# Altium schematic sheet IO.SchDoc
size A3
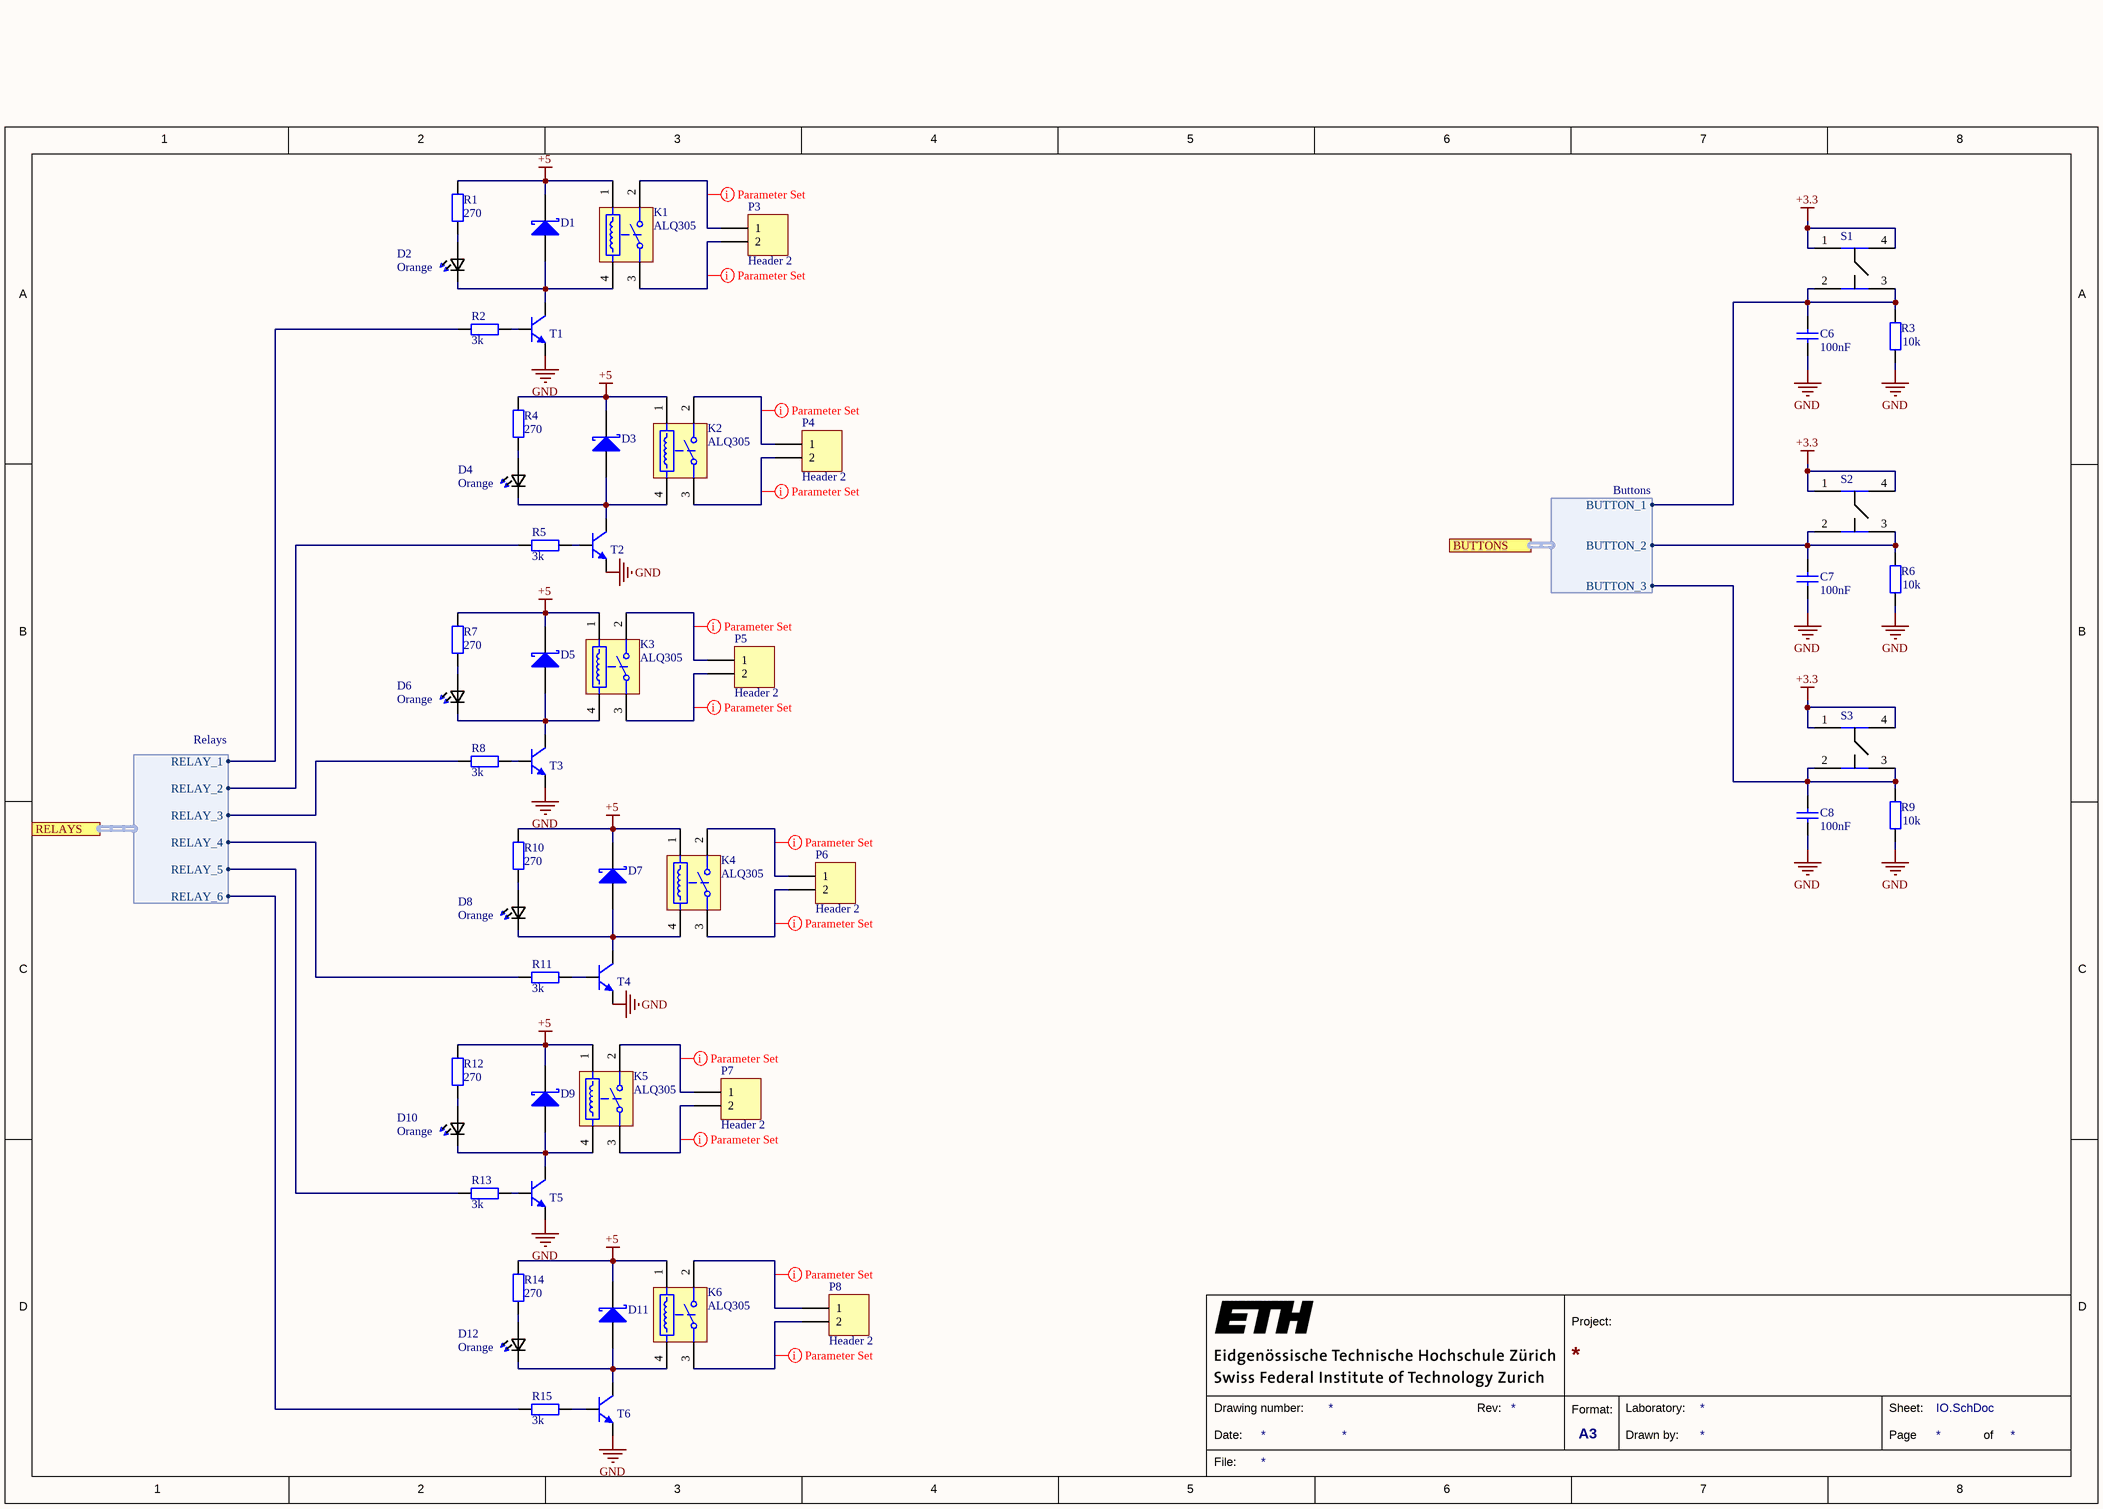
[diagram p0: IO.SchDoc]

## Parts
C6  100nF  [CAP_0603i_1608m -N]
C7  100nF  [CAP_0603i_1608m -N]
C8  100nF  [CAP_0603i_1608m -N]
D1  Diode  Schottky  [SOD123]  (value not drawn)
D2  Orange  [*0603]
D3  Diode  Schottky  [SOD123]  (value not drawn)
D4  Orange  [*0603]
D5  Diode  Schottky  [SOD123]  (value not drawn)
D6  Orange  [*0603]
D7  Diode  Schottky  [SOD123]  (value not drawn)
D8  Orange  [*0603]
D9  Diode  Schottky  [SOD123]  (value not drawn)
D10  Orange  [*0603]
D11  Diode  Schottky  [SOD123]  (value not drawn)
D12  Orange  [*0603]
K1  ALQ305  [PNSC-LQ-4-2000x1000x1600_V]
K2  ALQ305  [PNSC-LQ-4-2000x1000x1600_V]
K3  ALQ305  [PNSC-LQ-4-2000x1000x1600_V]
K4  ALQ305  [PNSC-LQ-4-2000x1000x1600_V]
K5  ALQ305  [PNSC-LQ-4-2000x1000x1600_V]
K6  ALQ305  [PNSC-LQ-4-2000x1000x1600_V]
P3  Header 2  [3.5MM Phoenix Contact 1984617]
P4  Header 2  [3.5MM Phoenix Contact 1984617]
P5  Header 2  [3.5MM Phoenix Contact 1984617]
P6  Header 2  [3.5MM Phoenix Contact 1984617]
P7  Header 2  [3.5MM Phoenix Contact 1984617]
P8  Header 2  [3.5MM Phoenix Contact 1984617]
R1  270  [RES_0603i_1608m -N]
R2  3k  [RES_0603i_1608m -N]
R3  10k  [RES_0603i_1608m -N]
R4  270  [RES_0603i_1608m -N]
R5  3k  [RES_0603i_1608m -N]
R6  10k  [RES_0603i_1608m -N]
R7  270  [RES_0603i_1608m -N]
R8  3k  [RES_0603i_1608m -N]
R9  10k  [RES_0603i_1608m -N]
R10  270  [RES_0603i_1608m -N]
R11  3k  [RES_0603i_1608m -N]
R12  270  [RES_0603i_1608m -N]
R13  3k  [RES_0603i_1608m -N]
R14  270  [RES_0603i_1608m -N]
R15  3k  [RES_0603i_1608m -N]
S1  EVQ-Q2U02W  [EVQQ2]  (value not drawn)
S2  EVQ-Q2U02W  [EVQQ2]  (value not drawn)
S3  EVQ-Q2U02W  [EVQQ2]  (value not drawn)
T1  Part Number: MMBT3904-7-F  [SOT-23-M]  (value not drawn)
T2  Part Number: MMBT3904-7-F  [SOT-23-M]  (value not drawn)
T3  Part Number: MMBT3904-7-F  [SOT-23-M]  (value not drawn)
T4  Part Number: MMBT3904-7-F  [SOT-23-M]  (value not drawn)
T5  Part Number: MMBT3904-7-F  [SOT-23-M]  (value not drawn)
T6  Part Number: MMBT3904-7-F  [SOT-23-M]  (value not drawn)

## Ports
BUTTONS (harness Buttons), RELAYS (harness Relays)

## Harnesses
Relays: RELAY_1, RELAY_2, RELAY_3, RELAY_4, RELAY_5, RELAY_6
Buttons: BUTTON_2, BUTTON_1, BUTTON_3

## Nets
+3.3: S1.1(NO_1) S1.4(NO_2) S2.1(NO_1) S2.4(NO_2) S3.1(NO_1) S3.4(NO_2)
+5: D1.2(K) D3.2(K) D5.2(K) D7.2(K) D9.2(K) D11.2(K) K1.1 K2.1 K3.1 K4.1 K5.1 K6.1 R1.2 R4.2 R7.2 R10.2 R12.2 R14.2
GND: C6.1 C7.1 C8.1 R3.1 R6.1 R9.1 T1.2(E) T2.2(E) T3.2(E) T4.2(E) T5.2(E) T6.2(E)
NetC6_2: C6.2 R3.2 S1.2(COM_1) S1.3(COM_2) ; port BUTTONS.BUTTON_1
NetC7_2: C7.2 R6.2 S2.2(COM_1) S2.3(COM_2) ; port BUTTONS.BUTTON_2
NetC8_2: C8.2 R9.2 S3.2(COM_1) S3.3(COM_2) ; port BUTTONS.BUTTON_3
NetD1_1: D1.1(A) D2.1(K2) K1.4 T1.3(C)
NetD2_2: D2.2(A2) R1.1
NetD3_1: D3.1(A) D4.1(K2) K2.4 T2.3(C)
NetD4_2: D4.2(A2) R4.1
NetD5_1: D5.1(A) D6.1(K2) K3.4 T3.3(C)
NetD6_2: D6.2(A2) R7.1
NetD7_1: D7.1(A) D8.1(K2) K4.4 T4.3(C)
NetD8_2: D8.2(A2) R10.1
NetD9_1: D9.1(A) D10.1(K2) K5.4 T5.3(C)
NetD10_2: D10.2(A2) R12.1
NetD11_1: D11.1(A) D12.1(K2) K6.4 T6.3(C)
NetD12_2: D12.2(A2) R14.1
NetK1_2: K1.2(NO) P3.1
NetK1_3: K1.3(COM) P3.2
NetK2_2: K2.2(NO) P4.1
NetK2_3: K2.3(COM) P4.2
NetK3_2: K3.2(NO) P5.1
NetK3_3: K3.3(COM) P5.2
NetK4_2: K4.2(NO) P6.1
NetK4_3: K4.3(COM) P6.2
NetK5_2: K5.2(NO) P7.1
NetK5_3: K5.3(COM) P7.2
NetK6_2: K6.2(NO) P8.1
NetK6_3: K6.3(COM) P8.2
NetR2_1: R2.1 T1.1(B)
NetR2_2: R2.2 ; port RELAYS.RELAY_1
NetR5_1: R5.1 T2.1(B)
NetR5_2: R5.2 ; port RELAYS.RELAY_2
NetR8_1: R8.1 T3.1(B)
NetR8_2: R8.2 ; port RELAYS.RELAY_3
NetR11_1: R11.1 T4.1(B)
NetR11_2: R11.2 ; port RELAYS.RELAY_4
NetR13_1: R13.1 T5.1(B)
NetR13_2: R13.2 ; port RELAYS.RELAY_5
NetR15_1: R15.1 T6.1(B)
NetR15_2: R15.2 ; port RELAYS.RELAY_6

## Layout directives
rule Clearance Constraint [Clearance = 15.748mil]: NetK1_2, NetK1_3, NetK2_2, NetK2_3, NetK3_2, NetK3_3, NetK4_2, NetK4_3, NetK5_2, NetK5_3, NetK6_2, NetK6_3

## Notes on the sheet
- 1
- 2
- 3
- 4
- 5
- 6
- 7
- 8
- A
- B
- C
- D
- Project:
- Date:
- Drawing number:
- Rev:
- Format:
- A3
- Drawn by:
- Laboratory:
- Page
- Sheet:
- of
- File:

## Library data of the parts
C6-C8 = Cap: capacitor
D1 D3 D5 D7 D9 D11 = Diode  Schottky: Schottky Diode
D2 D4 D6 D8 D10 D12 = LTST-C191KFKT: / LED; SMD; 0603; orange; 45-90mcd; 1.6x0.8x0.55mm; 130Â°; 2Ã·2.4V; 20mA /; MF: Lite-On Inc.; Digi-Key_Purchase_URL: https://www.digikey.com/product-detail/en/lite-on-inc/LTST-C191KFKT/160-1445-1-ND/386832?utm_source=snapeda&utm_medium=aggregator&utm_campaign=symbol; SnapEDA_Link: https://www.snapeda.com/parts/LTST-C191KFKT/Lite-On%20Inc./view-part/?ref=snap; MP: LTST-C191KFKT; Digi-Key_Part_Number: 160-1445-1-ND; Package: 0603 Lite-On; Value: *
K1-K6 = CMP-1503-00188-1: LQ Relays, 5 V Coil Voltage, 200 mW Nominal Operating Power, -40 to 85 degC, 4-Pin LQ, Carton, Case, RoHS; Manufacturer: Panasonic; Pb-Free: True; Nominal Operating Power: 200 mW; Max Switching Voltage: 250 V AC; Coil Voltage: 5 V; Max Switching Current: 10 A (N.O.), 3 A (N.C.); Mechanical Life(Min.operation): 1x10^7; Electrical Life: 5x10^4; ComponentLink2URL: http://www3.panasonic.biz/ac/e_download/control/relay/power/catalog/mech_eng_lq.pdf?f_cd=401220; ComponentLink3Description: Package Specification; PartNumber: ALQ305; PackageDescription: 4-Pin Through Hole Terminal Package, Body 20 x 10 mm; Packing: Carton, Case; ComponentLink2Description: Datasheet; ComponentLink1URL: http://www3.panasonic.biz/ac/ae/index.jsp; PackageReference: LQ-4-2000x1000x1600; DatasheetVersion: 201410-T; Mounting Technology: Through Hole; RoHS: True; ComponentLink3URL: http://www3.panasonic.biz/ac/e_download/control/relay/power/catalog/mech_eng_lq.pdf?f_cd=401220; ComponentLink1Description: Manufacturer URL; PackageVersion: ASCTB92E, 10/2014; Series: LQ Relays
P3-P8 = Header 2: Header, 2-Pin
R1-R15 = Res: Resistor
S1-S3 = EVQ-Q2U02W: White Button Tactile Switch, Single Pole Single Throw (SPST) 20 mA @ 15 V dc 0.7mm; Manufacturer_Name: Panasonic; Mouser Part Number: 667-EVQ-Q2U02W; Mouser Price/Stock: https://www.mouser.com/Search/Refine.aspx?Keyword=667-EVQ-Q2U02W; Manufacturer_Part_Number: EVQ-Q2U02W; Datasheet Link: https://componentsearchengine.com/Datasheets/1/EVQ-Q2U02W.pdf
T1-T6 = MMBT3904-7-F: No Description Available; Vendor: Diodes Inc; Built_By: EMA_UL_Team; Type: DEV; Manufacturer_Part_Number: MMBT3904-7-F; Copyright: Copyright (C) 2018 Accelerated Designs. All rights reserved; RefDes: RefDes; Value: Value